# EAGLE design eCog109_ISP_Programmer (EAGLE 6.6.0)
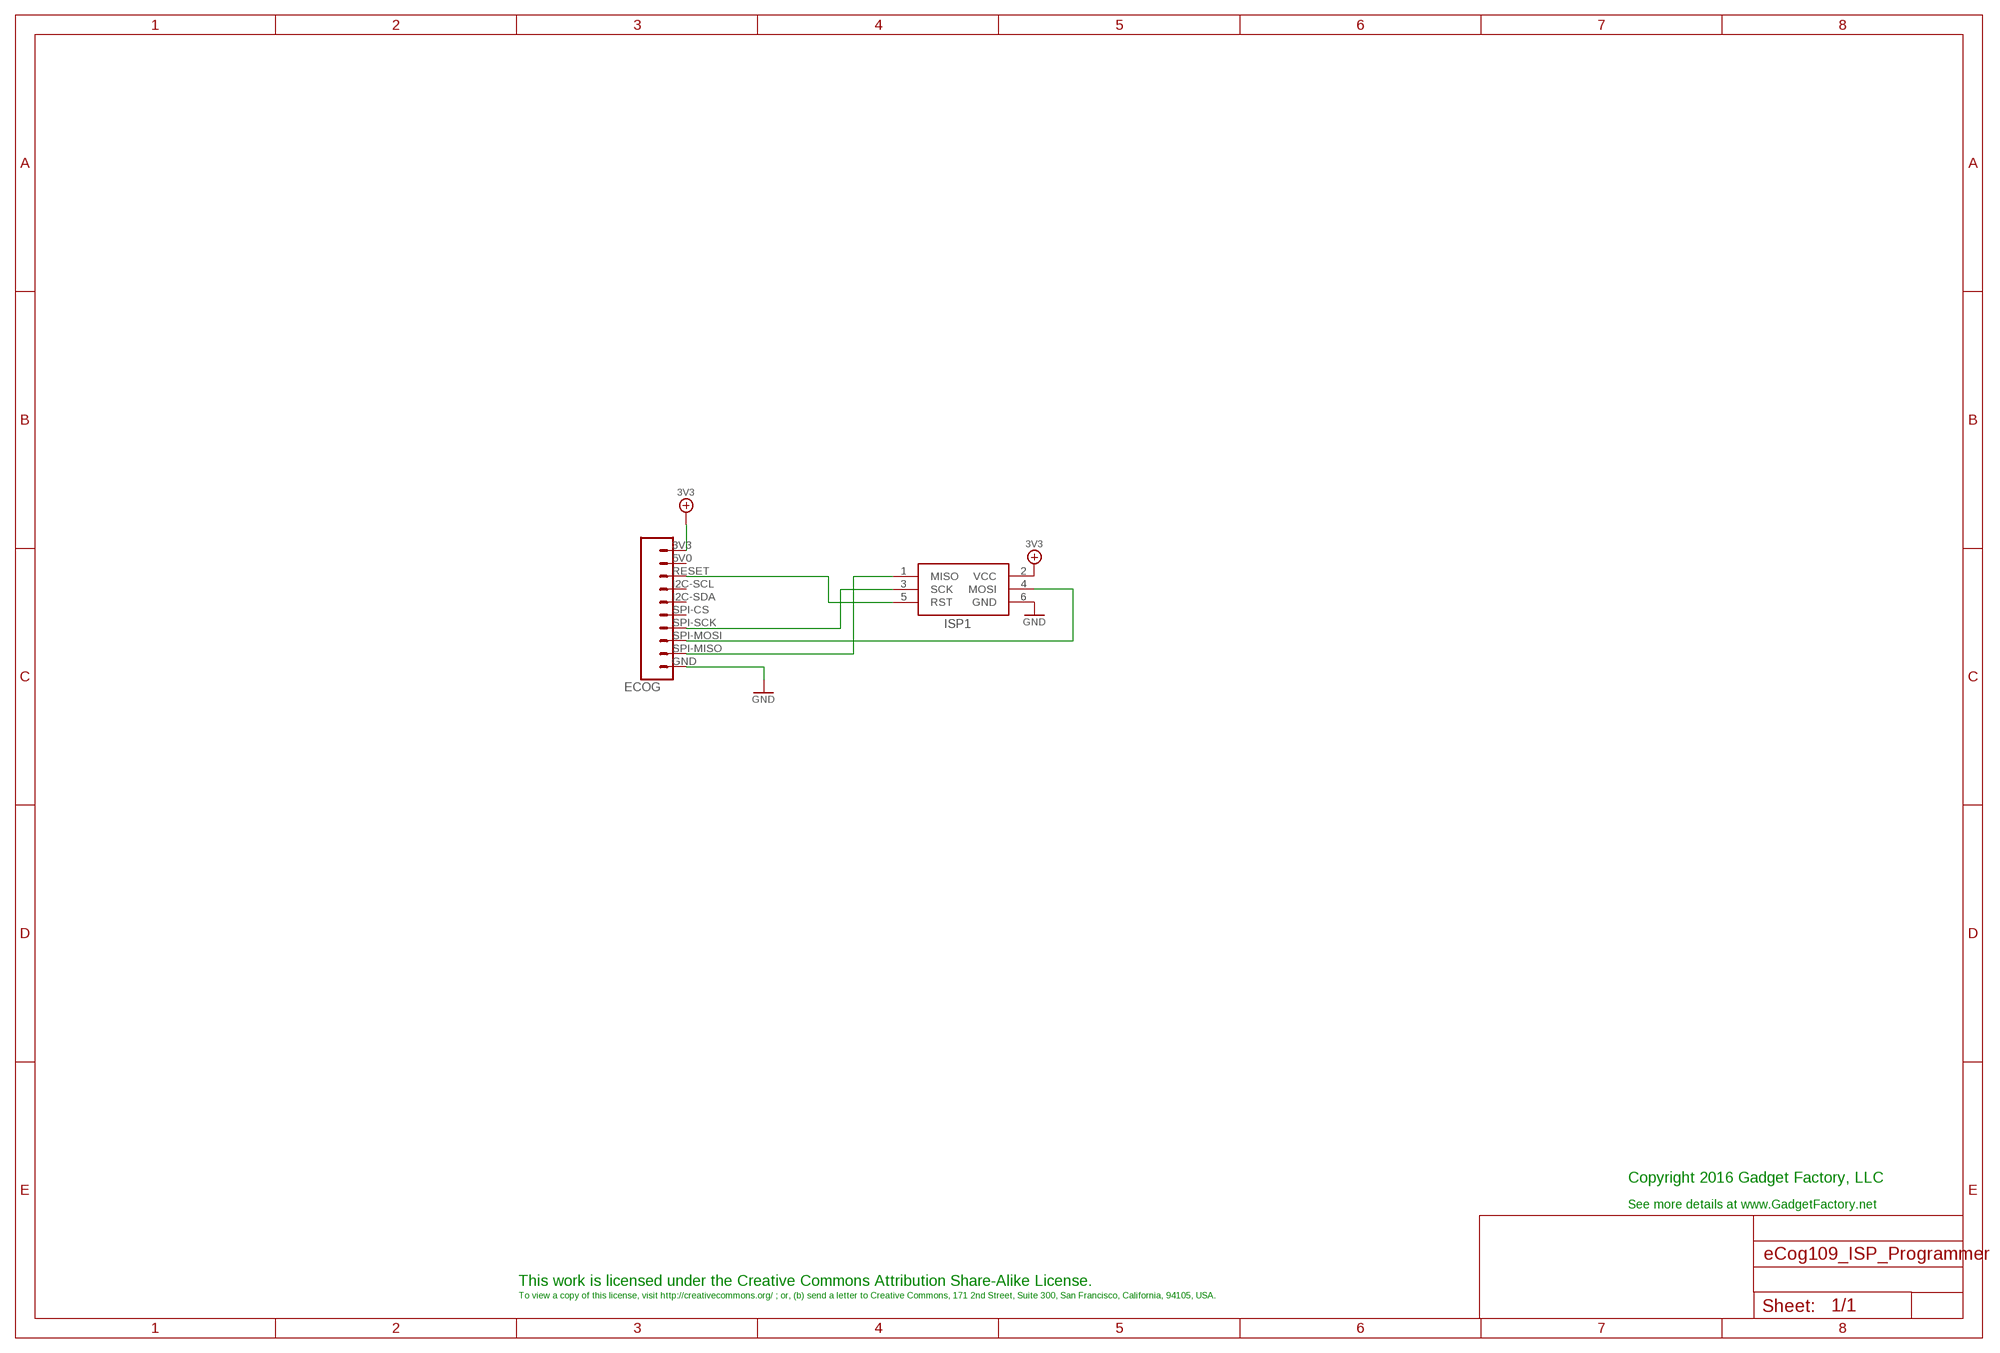
[diagram p0: schematic, sheet 1]

## Parts
ECOG  ECOG_BUSES_ROWECOG_BUSES_SMD  [ECOG_BUSES_SMD]
ISP1  AVRISP-6  [AVRISP]

## Nets
3V3: ECOG.3V3 ISP1.2(VCC)
GND: ECOG.GND ISP1.6(GND)
N$1: ECOG.SPI-MISO ISP1.1(MISO)
N$2: ECOG.SPI-SCK ISP1.3(SCK)
N$3: ECOG.RESET ISP1.5(RST)
N$4: ECOG.SPI-MOSI ISP1.4(MOSI)
Unconnected: ECOG.5V0 ECOG.I2C-SCL ECOG.I2C-SDA ECOG.SPI-CS

## Notes on the sheet
- Copyright 2016 Gadget Factory, LLC
- See more details at www.GadgetFactory.net
- This work is licensed under the Creative Commons Attribution Share-Alike License.
- To view a copy of this license, visit http://creativecommons.org/ ; or, (b) send a letter to Creative Commons, 171 2nd Street, Suite 300, San Francisco, California, 94105, USA.

## Library data of the parts
ECOG = eCogs:ECOG_BUSES_ROW; DIGIKEY: S1013EC-10-ND
ISP1 = adafruit:AVRISP: AVR ISP HEADER Standard 6 pin header for AVR programming

## Board
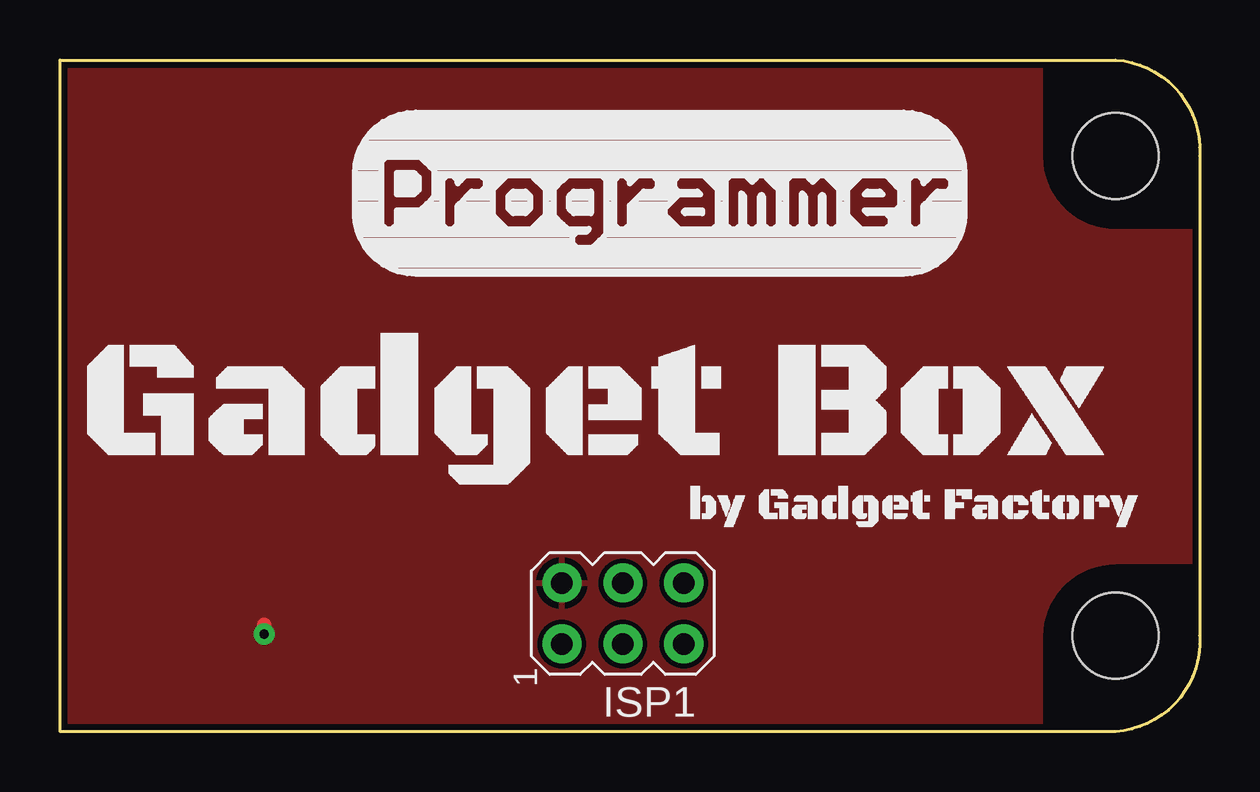
[diagram p1: board, top side]
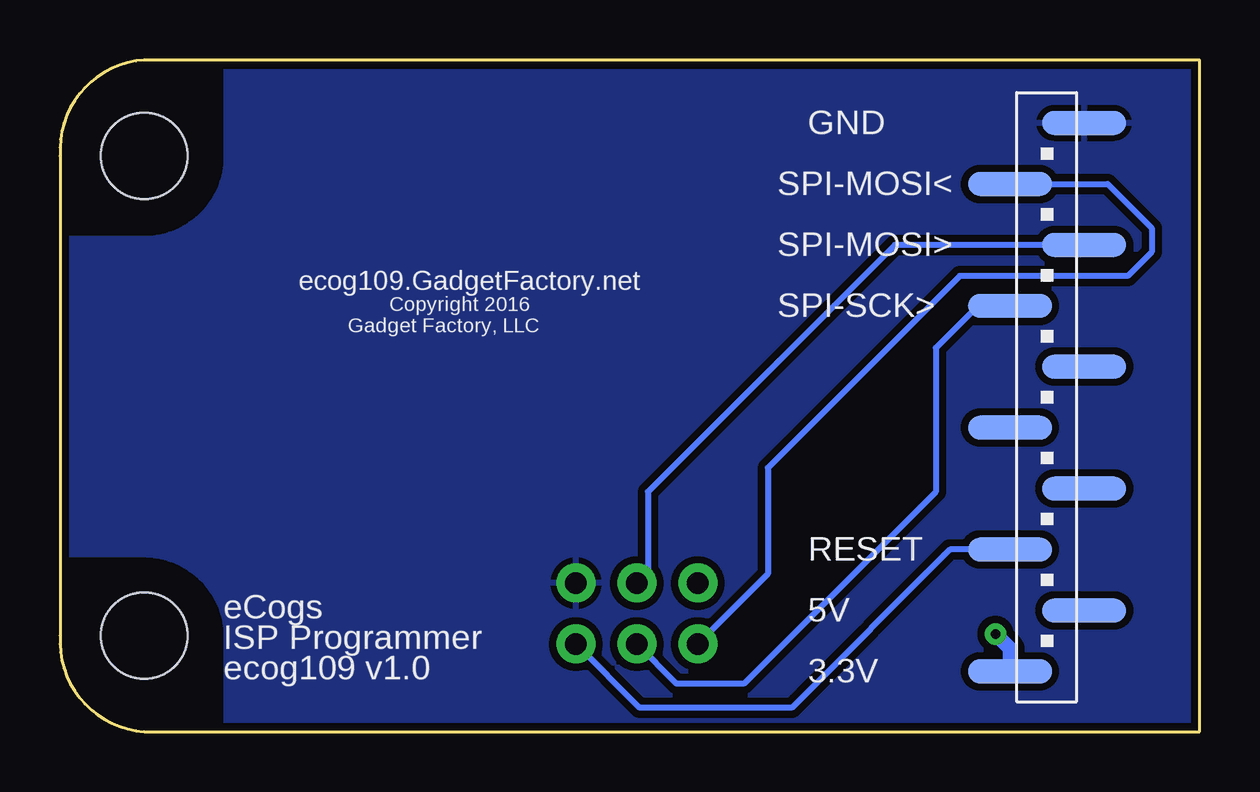
[diagram p2: board, bottom side, seen from below]

Size 47.51 x 28 mm. Coordinates in mm from the lower left corner, seen from the top.
Copper layers (1*16): Top 0.035mm / dielectric 1.5mm / Bottom 0.035mm
Design rules "SparkFun": minimum track width 8mil, minimum drill 20mil, track to track 8mil, track to pad 8mil, pad to pad 8mil, via to via 8mil, smd to smd 8mil, copper to edge 10mil, drill to drill 8mil, minimum pad ring 12mil, minimum via ring 10mil, stop-mask expansion 4mil, vias tented up to drill 25mil, thermal gap 10mil

### Footprints (pad centres in the part's own frame; a part is rotated, then mirrored left to right if it is on the bottom)
ECOG_BUSES_SMD = smd 3.5 x 1 bottom: 3V3 7.909,2.51; 5V0 4.811,5.05; GND 4.811,25.37; I2C-SCL 4.811,10.13; I2C-SDA 7.909,12.67; RESET 7.909,7.59; SPI-CS 4.811,15.21; SPI-MISO 7.909,22.83; SPI-MOSI 4.811,20.29; SPI-SCK 7.909,17.75 | hole 3.6: 44,4; 44,24
AVRISP = drill 0.9 pad 1.626: 1 -1.27,2.54; 2 1.27,2.54; 3 -1.27,0; 4 1.27,0; 5 -1.27,-2.54; 6 1.27,-2.54

### Placement (x,y rotation side)
ECOG  0,0 0 top
ISP1  23.46,4.92 90 top
U$1  [GADGETBOX_TEXT]  22.4,13.24 0 top

### Tracks (layer width: path | path; a pad name or v marks a point on that pad's centre or on a via)
3V3  (via drill 0.38)
  Top 0.61: v8.51,4.06 8.51,4.45
  Bottom 0.61: ECOG.3V3 7.91,3.46 v8.51,4.06
  pour Top: -1,29 49,29 49,-1 -1,-1
GND
  pour Bottom (isolate 0.305): -2,30 50,30 50,-2 -2,-2
N$1
  Bottom 0.254: ECOG.SPI-MISO 3.83,22.83 2,21 2,20 3,19 10,19 18,11 18,6.57 ISP1.1
N$2
  Bottom 0.254: ECOG.SPI-SCK 9.25,17.75 11,16 11,10 19,2 21.81,2 ISP1.3
N$3
  Bottom 0.254: ECOG.RESET 10.41,7.59 17,1 23.35,1 ISP1.5
N$4
  Bottom 0.254: ECOG.SPI-MOSI 12.71,20.29 23,10 23,6.65 ISP1.4

### Text on the board
bPlace: GND | SPI-MOSI< | SPI-MOSI> | Copyright 2016 | ecog109.GadgetFactory.net | SPI-SCK> | Gadget Factory, LLC | RESET | 5V | eCogs | ISP Programmer | 3.3V | ecog109 v1.0